# EAGLE design S88WirelessSender (EAGLE 7.0.0)
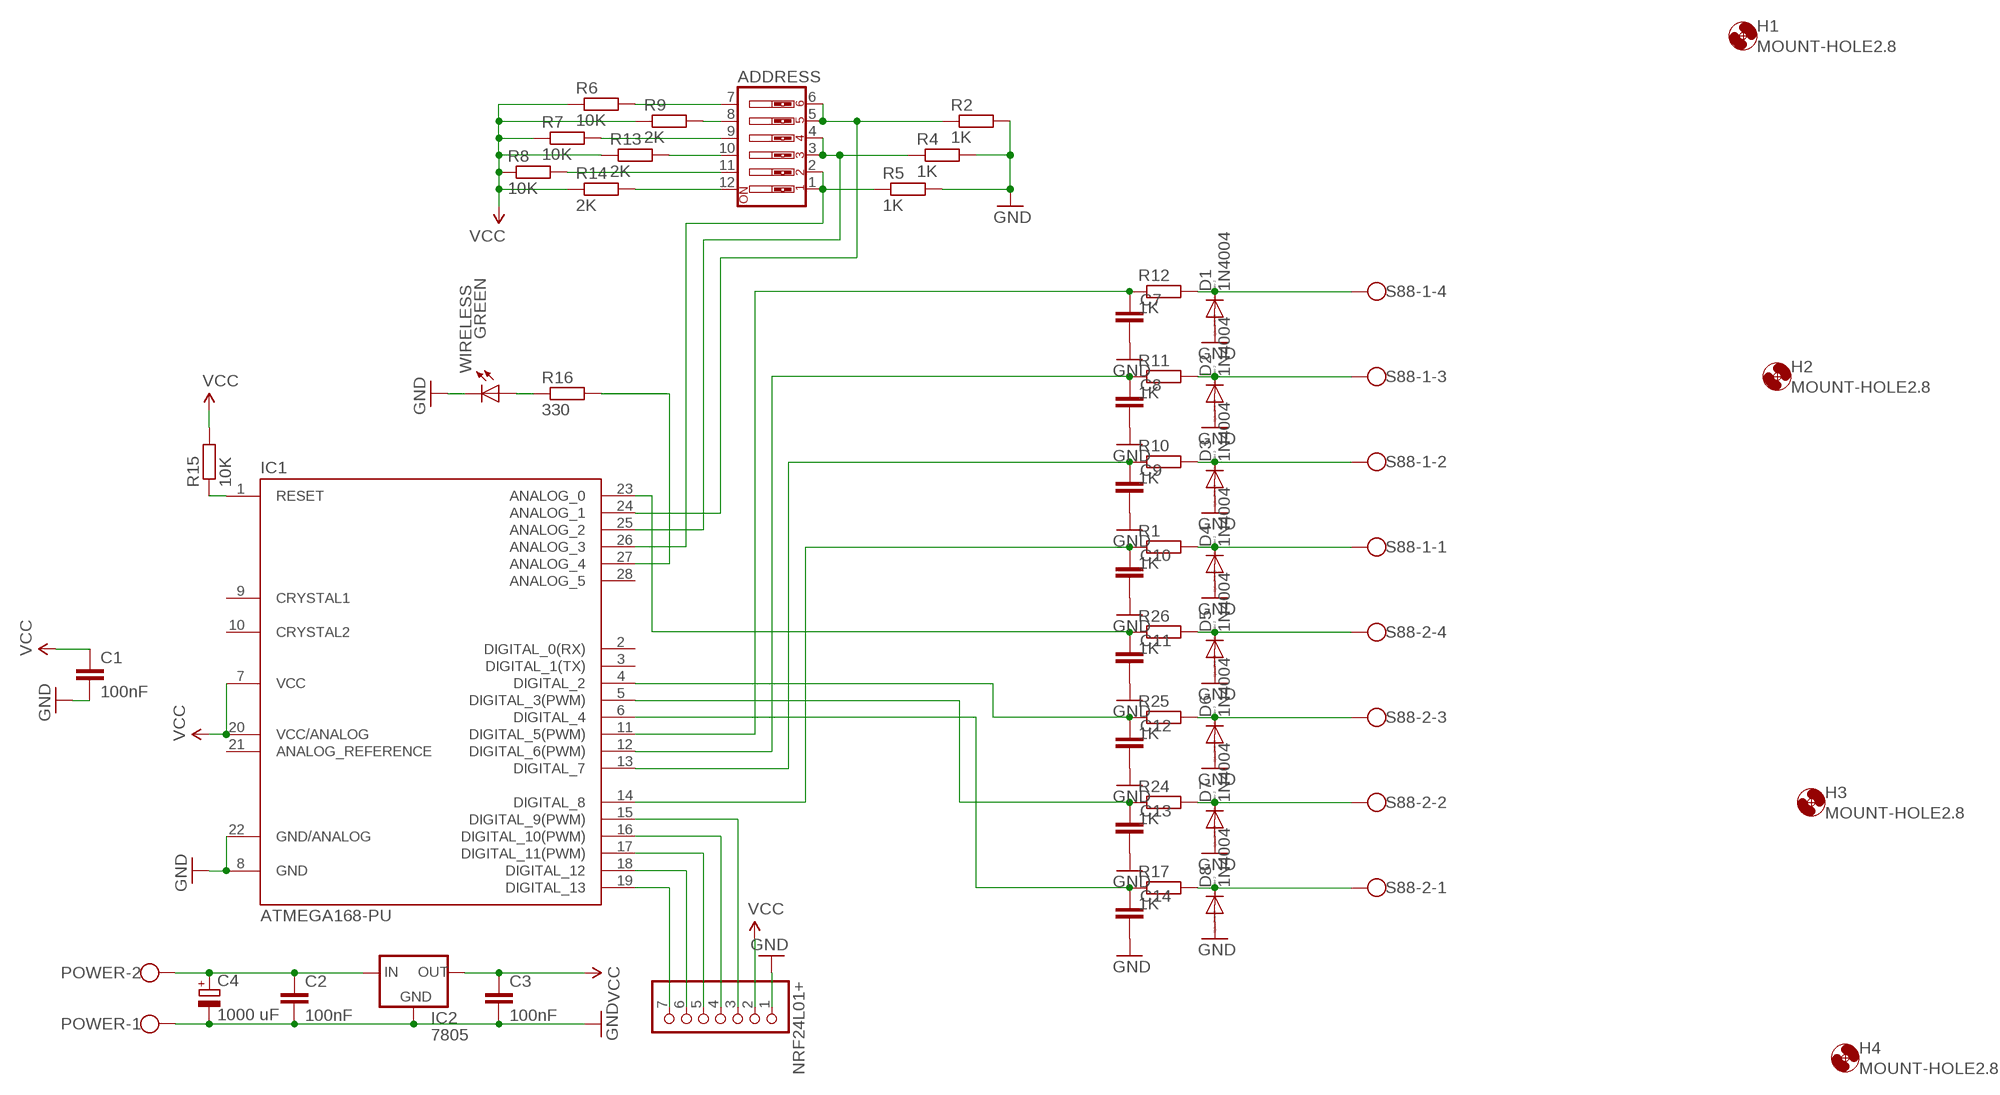
[diagram p0: schematic, sheet 1]

## Parts
ADDRESS  SW_DIP-6  [EDG-06]
C1  100nF  C-EU025-030X050  [C025-030X050]
C2  100nF  C-EU025-030X050  [C025-030X050]
C3  100nF  C-EU025-030X050  [C025-030X050]
C4  1000 uF  CPOL-EUE5-13  [E5-13]
C7  C-EU025-024X044  [C025-024X044]
C8  C-EU025-024X044  [C025-024X044]
C9  C-EU025-024X044  [C025-024X044]
C10  C-EU025-024X044  [C025-024X044]
C11  C-EU025-024X044  [C025-024X044]
C12  C-EU025-024X044  [C025-024X044]
C13  C-EU025-024X044  [C025-024X044]
C14  C-EU025-024X044  [C025-024X044]
D1  1N4004  [DO41-10]
D2  1N4004  [DO41-10]
D3  1N4004  [DO41-10]
D4  1N4004  [DO41-10]
D5  1N4004  [DO41-10]
D6  1N4004  [DO41-10]
D7  1N4004  [DO41-10]
D8  1N4004  [DO41-10]
H1  MOUNT-HOLE2.8  [2,8]
H2  MOUNT-HOLE2.8  [2,8]
H3  MOUNT-HOLE2.8  [2,8]
H4  MOUNT-HOLE2.8  [2,8]
IC1  ATMEGA168-PU  [DIL28-3]
IC2  7805  78XXS  [78XXS]
NRF24L01+  PINHD-1X7  [1X07]
POWER  W237-102  [W237-102]
R1  1K  R-EU_0204/7  [0204/7]
R2  1K  R-EU_0204/7  [0204/7]
R4  1K  R-EU_0204/7  [0204/7]
R5  1K  R-EU_0204/7  [0204/7]
R6  10K  R-EU_0204/2V  [0204V]
R7  10K  R-EU_0204/2V  [0204V]
R8  10K  R-EU_0204/2V  [0204V]
R9  2K  R-EU_0204/2V  [0204V]
R10  1K  R-EU_0204/7  [0204/7]
R11  1K  R-EU_0204/7  [0204/7]
R12  1K  R-EU_0204/7  [0204/7]
R13  2K  R-EU_0204/2V  [0204V]
R14  2K  R-EU_0204/2V  [0204V]
R15  10K  R-EU_0204/2V  [0204V]
R16  330  R-EU_0204/2V  [0204V]
R17  1K  R-EU_0204/7  [0204/7]
R24  1K  R-EU_0204/7  [0204/7]
R25  1K  R-EU_0204/7  [0204/7]
R26  1K  R-EU_0204/7  [0204/7]
S88-1  W237-4  [W237-4]
S88-2  W237-4  [W237-4]
WIRELESS  GREEN  LED3MM  [LED3MM]

## Nets
GND: C1.2 C2.2 C3.2 C4.- C7.2 C8.2 C9.2 C10.2 C11.2 C12.2 C13.2 C14.2 D1.A D2.A D3.A D4.A D5.A D6.A D7.A D8.A IC1.8(GND) IC1.22(GND/ANALOG) IC2.GND NRF24L01+.1 POWER.1 R2.2 R4.2 R5.2 WIRELESS.K(C)
N$2: IC1.16(DIGITAL_10(PWM)) NRF24L01+.4
N$3: IC1.15(DIGITAL_9(PWM)) NRF24L01+.3
N$4: IC1.19(DIGITAL_13) NRF24L01+.7
N$5: IC1.17(DIGITAL_11(PWM)) NRF24L01+.5
N$6: IC1.18(DIGITAL_12) NRF24L01+.6
N$7: D2.C R11.2 S88-1.3
N$9: D4.C R1.2 S88-1.1
N$10: D5.C R26.2 S88-2.4
N$11: D6.C R25.2 S88-2.3
N$12: D7.C R24.2 S88-2.2
N$13: ADDRESS.11 R8.2
N$14: ADDRESS.9 R7.2
N$15: ADDRESS.7 R6.2
N$16: ADDRESS.8 R9.2
N$17: D8.C R17.2 S88-2.1
N$19: C12.1 IC1.4(DIGITAL_2) R25.1
N$20: IC1.27(ANALOG_4) R16.2
N$21: ADDRESS.10 R13.2
N$22: ADDRESS.12 R14.2
N$23: ADDRESS.1 ADDRESS.2 IC1.26(ANALOG_3) R5.1
N$24: ADDRESS.3 ADDRESS.4 IC1.25(ANALOG_2) R4.1
N$25: C7.1 IC1.11(DIGITAL_5(PWM)) R12.1
N$26: C8.1 IC1.12(DIGITAL_6(PWM)) R11.1
N$27: C9.1 IC1.13(DIGITAL_7) R10.1
N$28: R16.1 WIRELESS.A
N$29: C10.1 IC1.14(DIGITAL_8) R1.1
N$30: ADDRESS.5 ADDRESS.6 IC1.24(ANALOG_1) R2.1
N$31: C11.1 IC1.23(ANALOG_0) R26.1
N$32: D1.C R12.2 S88-1.4
N$33: C13.1 IC1.5(DIGITAL_3(PWM)) R24.1
N$36: IC1.1(RESET) R15.1
N$37: C14.1 IC1.6(DIGITAL_4) R17.1
N$39: D3.C R10.2 S88-1.2
N$49: C2.1 C4.+ IC2.IN POWER.2
VCC: C1.1 C3.1 IC1.7(VCC) IC1.20(VCC/ANALOG) IC2.OUT NRF24L01+.2 R6.1 R7.1 R8.1 R9.1 R13.1 R14.1 R15.2
Unconnected: IC1.2(DIGITAL_0(RX)) IC1.3(DIGITAL_1(TX)) IC1.9(CRYSTAL1) IC1.10(CRYSTAL2) IC1.21(ANALOG_REFERENCE) IC1.28(ANALOG_5)

## Library data of the parts
ADDRESS = special:SW_DIP-6: DIP SWITCH
C1-C3 C7-C14 = rcl:C-EU: CAPACITOR, European symbol
C4 = rcl:CPOL-EU: POLARIZED CAPACITOR, European symbol
D1-D8 = diode:1N4004: DIODE general purpose rectifier, 1 A
H1-H4 = holes:MOUNT-HOLE: MOUNTING HOLE with drill center marker
IC1 = Arduino-AVR:ATMEGA168-PU
IC2 = v-reg:78XXS: VOLTAGE REGULATOR
NRF24L01+ = pinhead:PINHD-1X7: PIN HEADER
POWER = con-wago-500:W237-102: WAGO SCREW CLAMP; MPN: 237-102; OC_FARNELL: unknown; OC_NEWARK: 70K9898
R1 R2 R4 R5 R10-R12 R17 R24-R26 = rcl:R-EU_: RESISTOR, European symbol
R6-R9 R13-R16 = resistor:R-EU_: RESISTOR, European symbol
S88-1 S88-2 = con-wago-500:W237-4: WAGO SCREW CLAMP; OC_FARNELL: unknown; OC_NEWARK: unknown
WIRELESS = SparkFun-LED:LED: LEDs Standard schematic elements and footprints for 5mm, 3mm, 1206, and 0603 sized LEDs. 5mm - Spark Fun Electronics SKU : COM-00529 (and others)

## Board
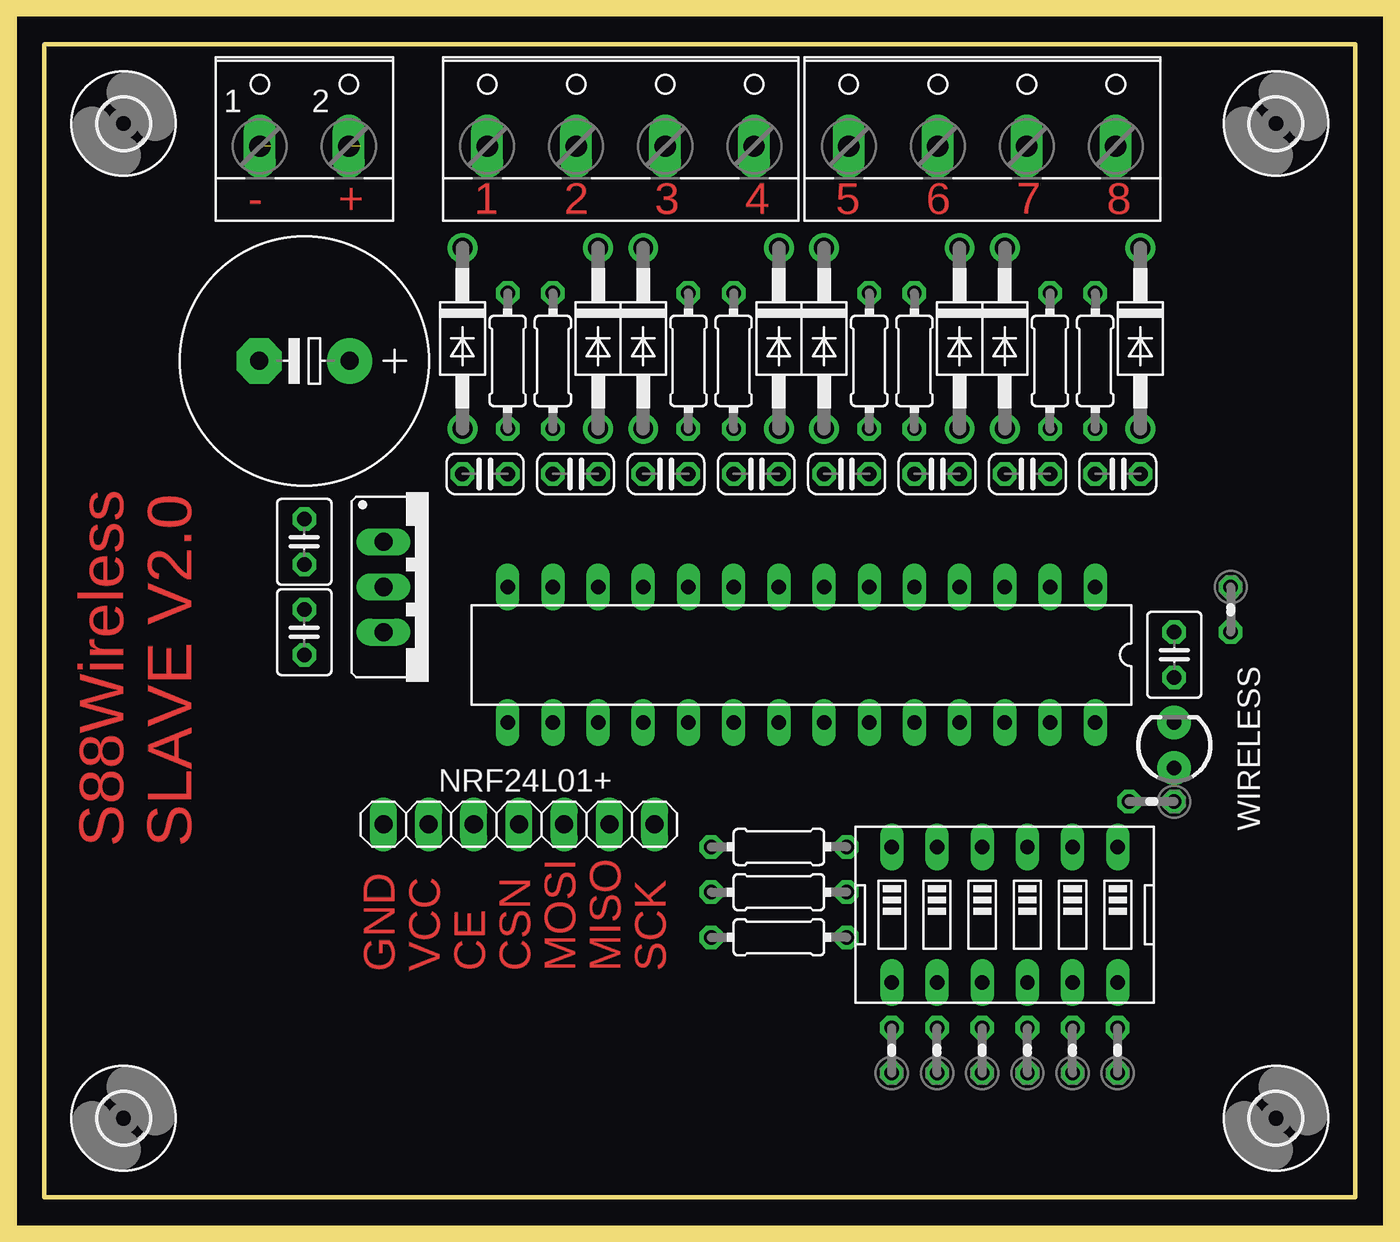
[diagram p1: board, top side]
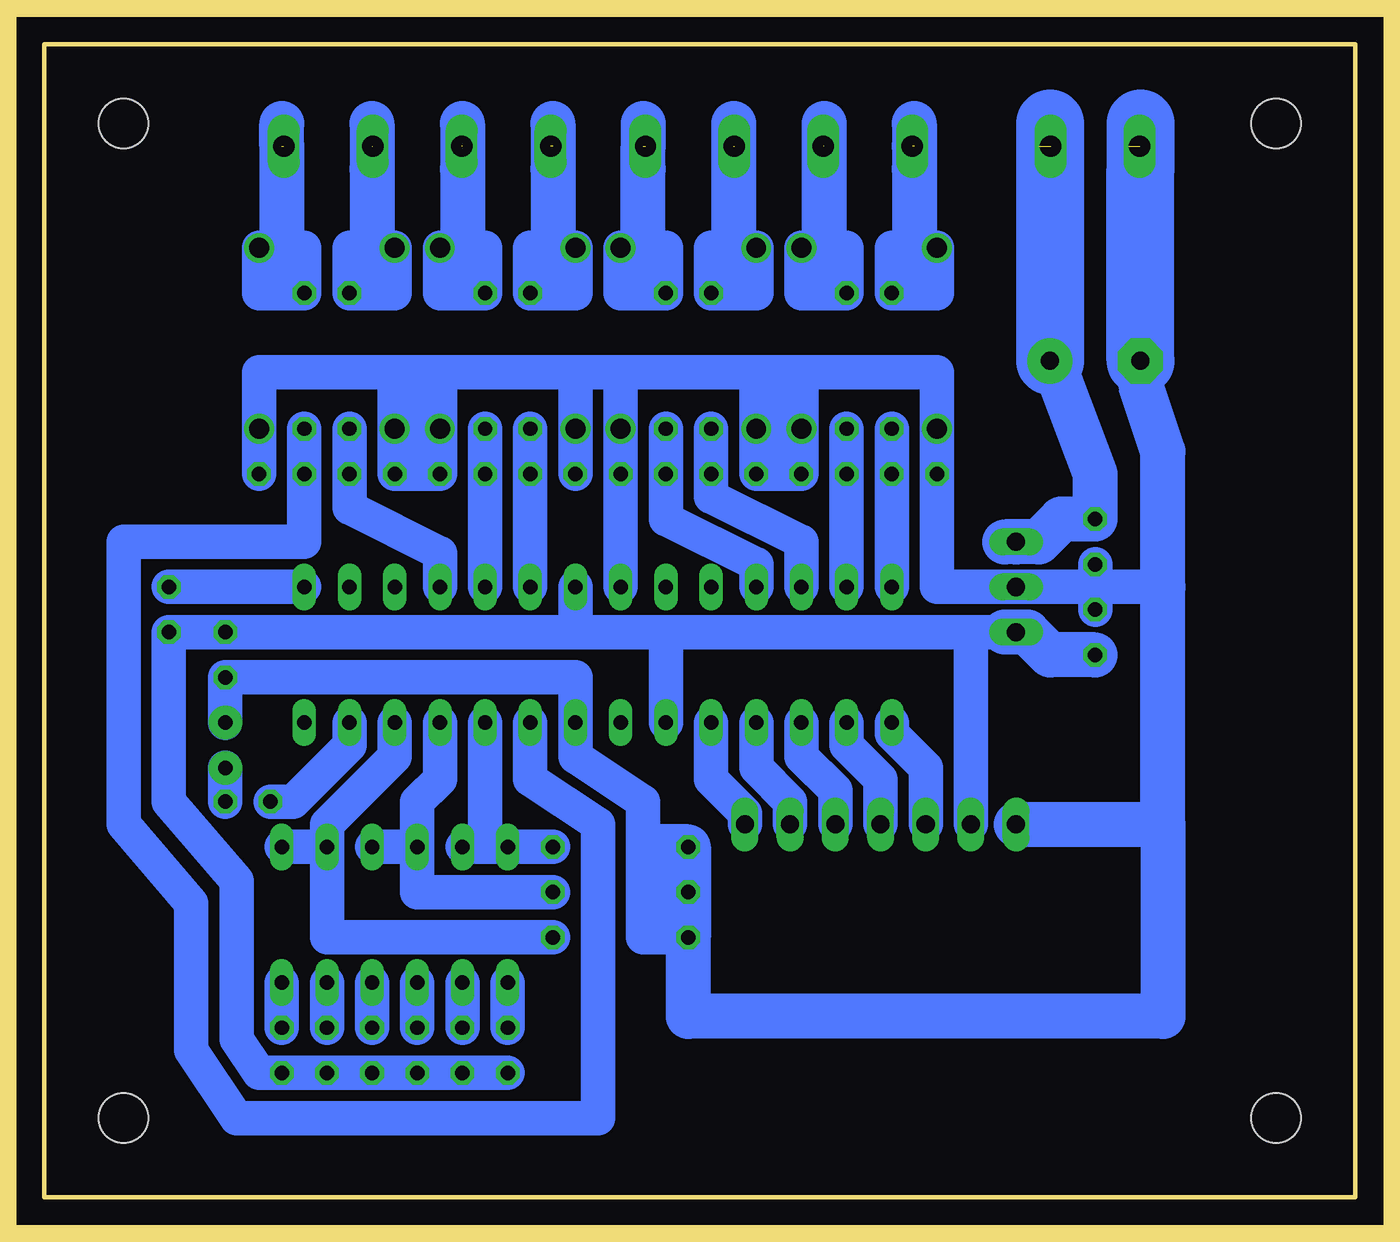
[diagram p2: board, bottom side, seen from below]

Size 73.66 x 64.77 mm. Coordinates in mm from the lower left corner, seen from the top.
Outline: 0,0 0,64.77 73.66,64.77 73.66,0 0,0
Copper layers (1*16): Top 0.035mm / dielectric 1.5mm / Bottom 0.035mm
Design rules "default": minimum track width 10mil, minimum drill 24mil, track to track 8mil, track to pad 8mil, pad to pad 8mil, via to via 8mil, smd to smd 8mil, copper to edge 40mil, drill to drill 8mil, minimum pad ring 10mil, minimum via ring 8mil, stop-mask expansion 4mil, vias tented up to drill 0mil, thermal gap 10mil
Milling: 4 lines

### Footprints (pad centres in the part's own frame; a part is rotated, then mirrored left to right if it is on the bottom)
EDG-06 = drill 0.813 long: 1 -6.35,-3.81; 2 -3.81,-3.81; 3 -1.27,-3.81; 4 1.27,-3.81; 5 3.81,-3.81; 6 6.35,-3.81; 7 6.35,3.81; 8 3.81,3.81; 9 1.27,3.81; 10 -1.27,3.81; 11 -3.81,3.81; 12 -6.35,3.81
C025-030X050 = drill 0.813 octagon: 1 -1.27,0; 2 1.27,0
E5-13 = drill 1.016 pad 2.54: + -2.54,0 | drill 1.016 pad 2.54 octagon: - 2.54,0
C025-024X044 = drill 0.813 octagon: 1 -1.27,0; 2 1.27,0
DO41-10 = drill 1.118: A 5.08,0; C -5.08,0
2,8 = hole 2.8: 0,0
DIL28-3 = drill 0.813 long: 1 -16.51,-3.81; 2 -13.97,-3.81; 3 -11.43,-3.81; 4 -8.89,-3.81; 5 -6.35,-3.81; 6 -3.81,-3.81; 7 -1.27,-3.81; 8 1.27,-3.81; 9 3.81,-3.81; 10 6.35,-3.81; 11 8.89,-3.81; 12 11.43,-3.81; 13 13.97,-3.81; 14 16.51,-3.81; 15 16.51,3.81; 16 13.97,3.81; 17 11.43,3.81; 18 8.89,3.81; 19 6.35,3.81; 20 3.81,3.81; 21 1.27,3.81; 22 -1.27,3.81; 23 -3.81,3.81; 24 -6.35,3.81; 25 -8.89,3.81; 26 -11.43,3.81; 27 -13.97,3.81; 28 -16.51,3.81
78XXS = drill 1.016 long: GND 0,-2.54; IN -2.54,-2.54; OUT 2.54,-2.54
1X07 = drill 1.016 long: 1 -7.62,0; 2 -5.08,0; 3 -2.54,0; 4 0,0; 5 2.54,0; 6 5.08,0; 7 7.62,0
W237-102 = drill 1.194 long: 1 -2.5,-1.27; 2 2.5,-1.27
0204/7 = drill 0.813 octagon: 1 -3.81,0; 2 3.81,0
0204V = drill 0.813 octagon: 1 -1.27,0; 2 1.27,0
W237-4 = drill 1.194 long: 1 -7.5,-1.27; 2 -2.5,-1.27; 3 2.5,-1.27; 4 7.5,-1.27
LED3MM = drill 0.813 pad 1.88: A -1.27,0; K 1.27,0

### Placement (x,y rotation side)
ADDRESS  53.98,15.88 180 top
C1  63.5,30.48 270 top
C2  14.61,36.83 270 top
C3  14.61,31.75 90 top
C4  14.61,46.99 180 top
C7  40.01,40.64 0 top
C8  34.93,40.64 180 top
C9  29.85,40.64 0 top
C10  24.77,40.64 180 top
C11  60.33,40.64 0 top
C12  55.25,40.64 180 top
C13  50.17,40.64 0 top
C14  45.09,40.64 180 top
D1  41.28,48.26 270 top
D2  33.66,48.26 270 top
D3  31.11,48.26 270 top
D4  23.5,48.26 270 top
D5  61.59,48.26 270 top
D6  53.98,48.26 270 top
D7  51.44,48.26 270 top
D8  43.82,48.26 270 top
H1  69.22,4.45 0 top
H2  69.22,60.33 0 top
H3  4.45,4.45 0 top
H4  4.45,60.33 0 top
IC1  42.55,30.48 180 top
IC2  21.59,34.29 270 top
NRF24L01+  26.67,20.95 0 top
POWER  14.61,60.33 0 top
R1  26.04,46.99 90 top
R2  41.28,19.68 180 top
R4  41.28,17.14 180 top
R5  41.28,14.61 180 top
R6  47.62,8.25 90 top
R7  52.71,8.25 90 top
R8  57.79,8.25 90 top
R9  50.17,8.25 90 top
R10  28.57,46.99 90 top
R11  36.2,46.99 90 top
R12  38.73,46.99 90 top
R13  55.25,8.25 90 top
R14  60.33,8.25 90 top
R15  66.67,33.02 270 top
R16  62.23,22.22 180 top
R17  46.36,46.99 90 top
R24  48.9,46.99 90 top
R25  56.52,46.99 90 top
R26  59.05,46.99 90 top
S88-1  32.39,60.33 0 top
S88-2  52.71,60.33 0 top
WIRELESS  63.5,25.4 90 top

### Tracks (layer width: path | path; a pad name or v marks a point on that pad's centre or on a via)
GND  (1 unrouted)
  Bottom 1.93: D3.A C9.2 C8.2 D2.A | 31.11,46.36 23.5,46.36 D4.A C10.2 23.5,34.29 IC2.GND 14.61,34.29 | 31.11,46.36 D3.A | D2.A 33.66,46.36 | 33.66,46.36 41.28,46.36 | 33.66,46.36 31.11,46.36 | D3.A D2.A | C14.2 D8.A 43.82,46.36 | D7.A C13.2 52.71,40.64 | D6.A C12.2 52.71,40.64 | C11.2 D5.A 61.59,46.36 53.98,46.36 | 53.98,46.36 D6.A | 53.98,46.36 52.71,46.36 | 52.71,46.36 51.44,46.36 | 51.44,46.36 D7.A | 51.44,46.36 43.82,46.36 | D7.A D6.A | 52.71,46.36 52.71,40.64 | 43.82,46.36 41.28,46.36 | C2.2 14.61,34.29 | 14.61,34.29 C3.2 | 10.8,34.29 14.61,34.29 | WIRELESS.K C1.2 43.82,29.21 IC1.22 43.82,24.77 40.01,22.22 40.01,19.68 | R2.2 R4.2 R5.2 40.01,14.61 40.01,19.68 | 39.37,19.68 40.01,19.68 | 12.07,57.79 12.7,59.05 | 41.28,46.36 D1.A C7.2 IC1.8
  Bottom 2.54: NRF24L01+.1 10.8,20.95 | 10.8,20.95 10.8,34.29 10.8,41.91 12.07,45.72 C4.- | 10.8,20.95 10.8,10.16 37.47,10.16 R5.2 R2.2 39.37,19.68
  Bottom 3.81: C4.- 12.07,57.79 12.07,60.33
N$1
  Bottom 1.93: 32.39,43.82 32.39,45.09
N$2
  Bottom 1.93: IC1.16 28.57,25.4 26.67,23.5 NRF24L01+.4
N$3
  Bottom 1.93: IC1.15 26.04,26.04 24.13,24.13 NRF24L01+.3
N$4
  Bottom 1.93: IC1.19 36.2,23.5 34.29,21.59 NRF24L01+.7
N$5
  Bottom 1.93: IC1.17 31.11,24.77 29.21,22.86 NRF24L01+.5
N$6
  Bottom 1.93: IC1.18 33.66,24.13 31.75,22.22 NRF24L01+.6
N$7  (1 unrouted)
  Bottom 1.93: 34.93,53.34 36.2,53.34 R11.2 33.66,50.8 D2.C 34.93,53.34 | 34.93,53.34 34.93,52.07
  Bottom 2.54: 34.93,53.34 34.93,57.79 34.93,59.05 34.93,60.33
N$9  (1 unrouted)
  Bottom 1.93: R1.2 23.5,50.8 D4.C 24.77,53.34 26.04,53.34 R1.2
  Bottom 2.54: 24.77,53.34 24.77,57.79 24.77,59.05 24.77,60.33
N$10  (1 unrouted)
  Bottom 1.93: D5.C 61.59,50.8 R26.2 59.05,53.34 60.33,53.34 D5.C
  Bottom 2.54: 60.33,53.34 60.33,58.42 60.33,59.05 60.33,60.33
N$11  (1 unrouted)
  Bottom 1.93: 55.25,59.05 55.25,57.79 | D6.C 53.98,50.8 R25.2 56.52,53.34 55.25,53.34 D6.C
  Bottom 2.54: 55.25,53.34 55.25,57.79 55.25,60.33
N$12  (1 unrouted)
  Bottom 1.93: 50.17,59.05 50.17,57.79 | R24.2 51.44,50.8 D7.C 50.17,53.34 48.9,53.34 R24.2
  Bottom 2.54: 50.17,53.34 50.17,57.79 50.17,60.33
N$13
  Bottom 1.93: ADDRESS.11 R8.2
N$14
  Bottom 1.93: ADDRESS.9 R7.2
N$15
  Bottom 1.93: ADDRESS.7 R6.2
N$16
  Bottom 1.93: ADDRESS.8 R9.2
N$17  (1 unrouted)
  Bottom 1.93: 45.09,59.05 45.09,57.79 | D8.C 43.82,50.8 R17.2 46.36,53.34 45.09,53.34 D8.C
  Bottom 2.54: 45.09,53.34 45.09,57.79 45.09,60.33
N$18
  Bottom 1.93: 40.01,52.07 40.64,52.07
N$19
  Bottom 1.93: R25.1 C12.1 56.52,38.73 51.44,36.2 IC1.4
N$20
  Bottom 1.93: IC1.27 56.52,25.4 59.69,22.22 R16.2
N$21
  Bottom 1.93: ADDRESS.10 R13.2
N$22
  Bottom 1.93: ADDRESS.12 R14.2
N$23
  Bottom 1.93: IC1.26 53.98,24.77 57.79,20.95 ADDRESS.2 | ADDRESS.2 ADDRESS.1 | ADDRESS.2 57.79,14.61 R5.1
N$24
  Bottom 1.93: ADDRESS.4 52.71,17.14 R4.1 | ADDRESS.3 ADDRESS.4 | IC1.25 51.44,23.5 52.71,22.22 ADDRESS.4
N$25
  Bottom 1.93: R12.1 C7.1 38.73,38.1 33.66,35.56 IC1.11
N$26
  Bottom 1.93: R11.1 C8.1 36.2,39.37 31.11,36.83 IC1.12
N$27
  Bottom 1.93: R10.1 C9.1 IC1.13
N$28
  Bottom 1.93: WIRELESS.A R16.1
N$29
  Bottom 1.93: R1.1 C10.1 IC1.14
N$30
  Bottom 1.93: IC1.24 48.9,20.32 ADDRESS.5 ADDRESS.6 R2.1
N$31
  Bottom 1.93: R26.1 C11.1 59.05,36.83 69.22,36.83 69.22,20.95 65.41,16.51 65.41,8.25 62.87,4.45 42.55,4.45 42.55,20.95 46.36,23.5 IC1.23
N$32  (1 unrouted)
  Bottom 1.93: 40.01,53.34 38.73,53.34 R12.2 41.28,50.8 D1.C
  Bottom 2.54: 40.01,53.34 40.01,57.79 40.01,59.05 40.01,60.33
N$33
  Bottom 1.93: R24.1 C13.1 IC1.5
N$34
  Bottom 1.93: 32.39,42.55 32.39,40.64
N$36
  Bottom 1.93: IC1.1 R15.1
N$37
  Bottom 1.93: R17.1 C14.1 IC1.6
N$39  (1 unrouted)
  Bottom 1.93: D3.C 31.11,50.8 R10.2 28.57,53.34 29.85,53.34 D3.C
  Bottom 2.54: 29.85,53.34 29.85,57.79 29.85,59.05 29.85,60.33
N$41
  Bottom 1.93: 45.72,52.07 45.09,52.07
N$42
  Bottom 1.93: 50.17,52.07 49.53,52.07
N$43
  Bottom 1.93: 55.25,52.07 55.88,52.07
N$44
  Bottom 1.93: 60.96,52.07 60.33,52.07
N$45
  Bottom 1.93: 29.21,52.07 30.48,52.07
N$46
  Bottom 1.93: 25.4,52.07 24.77,52.07
N$48
  Bottom 2.54: 38.73,19.05 38.73,15.24
N$49  (1 unrouted)
  Bottom 1.93: 17.78,59.05 17.14,57.79
  Bottom 2.54: C4.+ 16.51,45.72 14.61,40.64 C2.1 16.51,38.1 17.78,36.83 IC2.IN 19.68,36.83
  Bottom 3.81: C4.+ 17.14,57.79 17.14,60.33
VCC
  Bottom 1.93: R6.1 R9.1 R7.1 R13.1 R8.1 R14.1 61.59,6.99 62.87,8.89 62.87,17.78 66.67,22.22 R15.2 C1.1 43.82,31.75 | IC1.20 38.73,31.75 | 38.73,31.75 43.82,31.75 | IC1.7 43.82,31.75 | 19.68,31.75 21.59,31.75 | 21.59,31.75 38.73,31.75 | NRF24L01+.2 21.59,31.75
  Bottom 2.54: C3.1 17.14,30.48 18.41,31.75 IC2.OUT 19.68,31.75

### Text on the board
Top: - | + | 1 | 2 | 3 | 4 | 5 | 6 | 7 | 8 | S88Wireless / SLAVE V2.0 | GND | VCC | CE | CSN | MOSI | MISO | SCK